# Altium schematic sheet MCU.SchDoc
size B; SheetNumber: 6; SheetTotal: 6; SPICEModelCacheVOGBEKYM: <root> / <DocumentId>VOGBEKYM</DocumentId> / <CacheFrame Number="0"> / <Model Name="xtal" Kind="CKT"> / <Text>*Generic type:crystal pkg:HC33/51 / .SUBCKT XTAL 1 2 PARAMS: FREQ=1Meg RS=750 C=13pf Q=1000 / LX 1 3 {((Q*RS)/(6.2831852*FREQ))} IC=0.5M / CX 3 4 {(1/(Q*6.2831852*FREQ*RS))} / C0 1 2 {C} / RS 4 2 {RS} / .ENDS XTAL</Text> / </Model> / <Model Name="led1" Kind="MDL"> / <Text>*Typ RED GaAs LED: Vf=1.7V Vr=4V If=40mA trr=3uS / *LED Pinout: 1=A, 2=K / .MODEL LED1 D (IS=93.2P RS=42M N=3.73 BV=4 IBV=10U / + CJO=2.97P VJ=.75 M=.333 TT=4.32U)</Text> / </Model> / </CacheFrame> / </root>
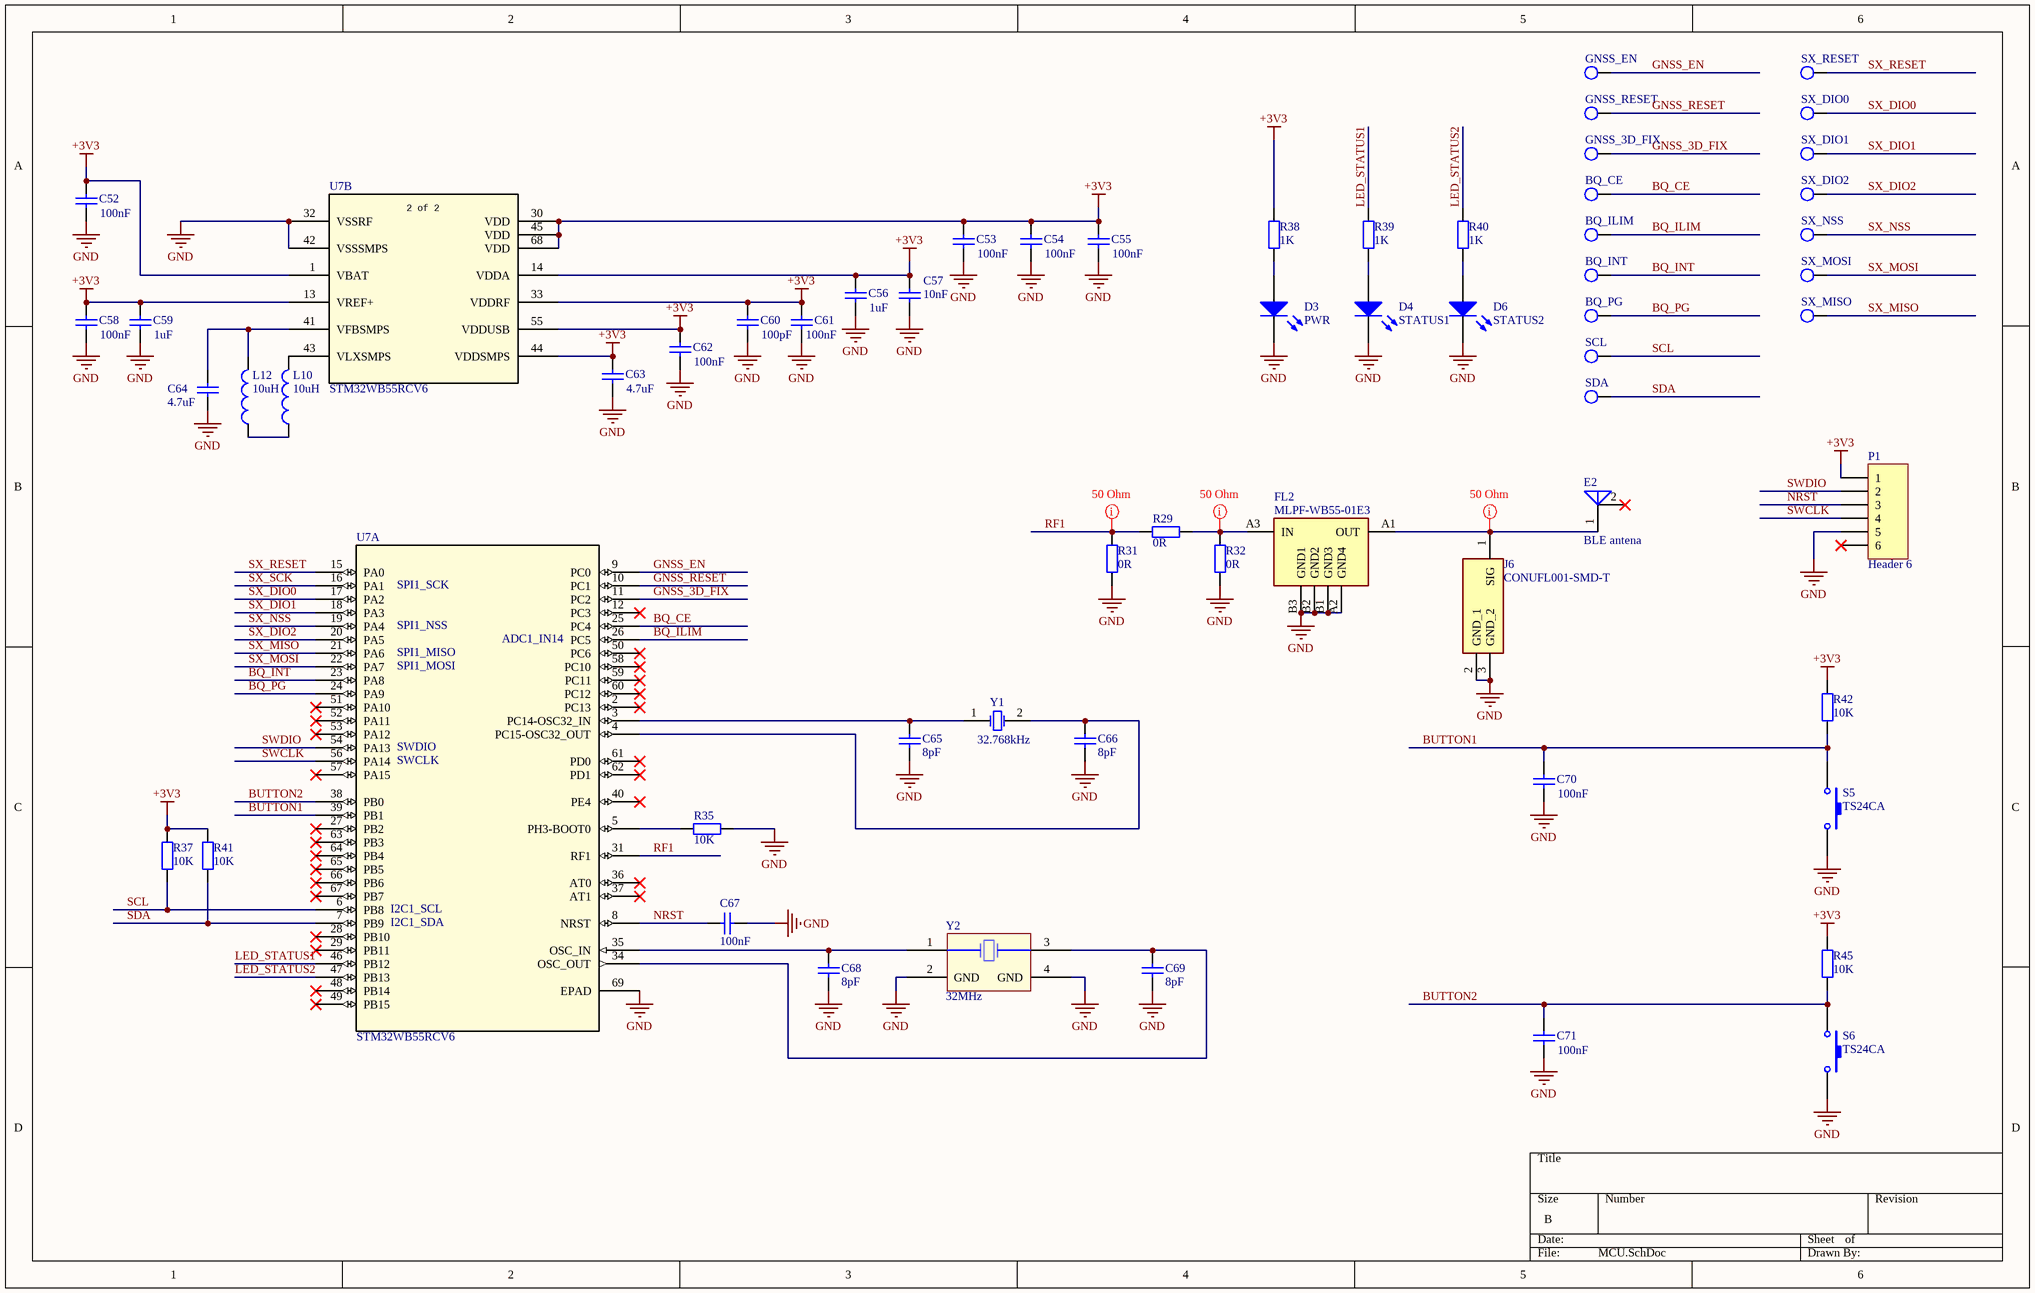
[diagram p0: MCU.SchDoc]

## Parts
BQ_CE  BQ_CE  [testpoint 1 mm]  (value not drawn)  (no BOM)
BQ_ILIM  BQ_ILIM  [testpoint 1 mm]  (value not drawn)  (no BOM)
BQ_INT  BQ_INT  [testpoint 1 mm]  (value not drawn)  (no BOM)
BQ_PG  BQ_PG  [testpoint 1 mm]  (value not drawn)  (no BOM)
C52  100nF  [SMD-0402C]
C53  100nF  [SMD-0402C]
C54  100nF  [SMD-0402C]
C55  100nF  [SMD-0402C]
C56  1uF  [SMD-0402C]
C57  10nF  [SMD-0402C]
C58  100nF  [SMD-0402C]
C59  1uF  [SMD-0402C]
C60  100pF  [SMD-0402C]
C61  100nF  [SMD-0402C]
C62  100nF  [SMD-0402C]
C63  4.7uF  [SMD-0603C]
C64  4.7uF  [SMD-0603C]
C65  8pF  [SMD-0402C]
C66  8pF  [SMD-0402C]
C67  100nF  [SMD-0402C]
C68  8pF  [SMD-0402C]
C69  8pF  [SMD-0402C]
C70  100nF  [SMD-0402C]
C71  100nF  [SMD-0402C]
D3  PWR  [LED 0603]
D4  STATUS1  [LED 0603]
D6  STATUS2  [LED 0603]
E2  BLE antena  [ANT3216LL00R2400A]
FL2  MLPF-WB55-01E3  [MLPF-WB55-01E3]
GNSS_3D_FIX  GNSS_EN  [testpoint 1 mm]  (value not drawn)  (no BOM)
GNSS_EN  GNSS_EN  [testpoint 1 mm]  (value not drawn)  (no BOM)
GNSS_RESET  GNSS_RESET  [testpoint 1 mm]  (value not drawn)  (no BOM)
J6  CONUFL001-SMD-T  [CONUFL001SMDT]
L10  10uH  [SMD-0805-RES]
L12  10uH  [SMD-0805-RES]
P1  Header 6  [TAG_TC2030-IDC-NL]
R29  0R  [SMD-0402-RES]
R31  0R  [SMD-0402-RES]
R32  0R  [SMD-0402-RES]
R35  10K  [SMD-0402-RES]
R37  10K  [SMD-0402-RES]
R38  1K  [SMD-0402-RES]
R39  1K  [SMD-0402-RES]
R40  1K  [SMD-0402-RES]
R41  10K  [SMD-0402-RES]
R42  10K  [SMD-0402-RES]
R45  10K  [SMD-0402-RES]
S5  TS24CA  [TS24CA]
S6  TS24CA  [TS24CA]
SCL  SCL  [testpoint 1 mm]  (value not drawn)  (no BOM)
SDA  SDA  [testpoint 1 mm]  (value not drawn)  (no BOM)
SX_DIO0  SX_DIO0  [testpoint 1 mm]  (value not drawn)  (no BOM)
SX_DIO1  SX_DIO1  [testpoint 1 mm]  (value not drawn)  (no BOM)
SX_DIO2  SX_DIO2  [testpoint 1 mm]  (value not drawn)  (no BOM)
SX_MISO  SX_MISO  [testpoint 1 mm]  (value not drawn)  (no BOM)
SX_MOSI  SX_MOSI  [testpoint 1 mm]  (value not drawn)  (no BOM)
SX_NSS  SX_NSS  [testpoint 1 mm]  (value not drawn)  (no BOM)
SX_RESET  SX_RESET  [testpoint 1 mm]  (value not drawn)  (no BOM)
U7  STM32WB55RCV6  [STM32WB55RCV6]  (parts A,B of 2)
Y1  32.768kHz  [DT1610SB32768B0HPWAA]
Y2  32MHz  [ECS-TXO-20CSMV-320-EY-TR]

## Nets
+3V3: C52.2 C53.2 C54.2 C55.2 C56.2 C57.2 C58.2 C59.2 C60.2 C61.2 C62.2 C63.2 P1.1 R37.2 R38.1 R41.2 R42.2 R45.2 U7.1(VBAT) U7.13(VREF+) U7.14(VDDA) U7.30(VDD) U7.33(VDDRF) U7.44(VDDSMPS) U7.45(VDD) U7.55(VDDUSB) U7.68(VDD)
GND: C52.1 C53.1 C54.1 C55.1 C56.1 C57.1 C58.1 C59.1 C60.1 C61.1 C62.1 C63.1 C64.1 C65.2 C66.2 C67.1 C68.2 C69.2 C70.1 C71.1 D3.2(K) D4.2(K) D6.2(K) FL2.A2(GND4) FL2.B1(GND3) FL2.B2(GND2) FL2.B3(GND1) J6.2(GND_1) J6.3(GND_2) P1.5 R31.1 R32.1 R35.1 S5.2 S6.2 U7.32(VSSRF) U7.42(VSSSMPS) U7.69(EPAD) Y2.2(GND) Y2.4(GND)
BQ_CE: BQ_CE.1 U7.25(PC4)
BQ_ILIM: BQ_ILIM.1 U7.26(PC5)
BQ_INT: BQ_INT.1 U7.23(PA8)
BQ_PG: BQ_PG.1 U7.24(PA9)
BUTTON1: C70.2 R42.1 S5.1 U7.39(PB1)
BUTTON2: C71.2 R45.1 S6.1 U7.38(PB0)
GNSS_3D_FIX: GNSS_3D_FIX.1 U7.11(PC2)
GNSS_EN: GNSS_EN.1 U7.9(PC0)
GNSS_RESET: GNSS_RESET.1 U7.10(PC1)
LED_STATUS1: R39.1 U7.46(PB12)
LED_STATUS2: R40.1 U7.47(PB13)
NRST: C67.2 P1.3 U7.8(NRST)
RF1: R29.2 R31.2 U7.31(RF1)
SCL: R37.1 SCL.1 U7.6(PB8)
SDA: R41.1 SDA.1 U7.7(PB9)
SWCLK: P1.4 U7.56(PA14)
SWDIO: P1.2 U7.54(PA13)
SX_DIO0: SX_DIO0.1 U7.17(PA2)
SX_DIO1: SX_DIO1.1 U7.18(PA3)
SX_DIO2: SX_DIO2.1 U7.20(PA5)
SX_MISO: SX_MISO.1 U7.21(PA6)
SX_MOSI: SX_MOSI.1 U7.22(PA7)
SX_NSS: SX_NSS.1 U7.19(PA4)
SX_RESET: SX_RESET.1 U7.15(PA0)
SX_SCK: U7.16(PA1)
NetC64_2: C64.2 L12.2 U7.41(VFBSMPS)
NetC65_1: C65.1 U7.3(PC14-OSC32_IN) Y1.1(OSC1)
NetC66_1: C66.1 U7.4(PC15-OSC32_OUT) Y1.2(OSC2)
NetC68_1: C68.1 U7.35(OSC_IN) Y2.1
NetC69_1: C69.1 U7.34(OSC_OUT) Y2.3
NetD3_1: D3.1(A) R38.2
NetD4_1: D4.1(A) R39.2
NetD6_1: D6.1(A) R40.2
NetE2_1: E2.1 FL2.A1(OUT) J6.1(SIG)
NetFL2_A3: FL2.A3(IN) R29.1 R32.2
NetL10_1: L10.1 L12.1
NetL10_2: L10.2 U7.43(VLXSMPS)
NetR35_2: R35.2 U7.5(PH3-BOOT0)

Not connected (* = marked no-connect by the designer): E2 2*; P1 6*; U7 2(PC13)* 12(PC3)* 27(PB2)* 28(PB10)* 29(PB11)* 36(AT0)* 37(AT1)* 40(PE4)* 48(PB14)* 49(PB15)* 50(PC6)* 51(PA10)* 52(PA11)* 53(PA12)* 57(PA15)* 58(PC10)* 59(PC11)* 60(PC12)* 61(PD0)* 62(PD1)* 63(PB3)* 64(PB4)* 65(PB5)* 66(PB6)* 67(PB7)*

## Layout directives
net class 50 Ohm BLE GNSS: NetE2_1, NetFL2_A3, RF1

## Notes on the sheet
- (in symbol STM32WB55RCV6, part A) SPI1_SCK; SPI1_NSS; ADC1_IN14; SPI1_MISO; SPI1_MOSI; SWDIO; SWCLK; I2C1_SCL; I2C1_SDA
- (in symbol STM32WB55RCV6, part B) 2 of 2

## Library data of the parts
BQ_CE BQ_ILIM BQ_INT BQ_PG GNSS_3D_FIX GNSS_EN GNSS_RESET SCL SDA SX_DIO0-SX_DIO2 SX_MISO SX_MOSI SX_NSS SX_RESET = testpoint
C52-C71 = Cap: Capacitor; Published: 8-Jun-2000; LatestRevisionDate: 17-Jul-2002; LatestRevisionNote: Re-released for DXP Platform.; PackageReference: RAD-0.3; Publisher: Altium Limited; PackageDescription: Radial Cap, Thru-Hole; 2 Leads; 0.3 in Pin Spacing; Supplier 1: Mouser
  C52-C55 C58 C61 C62 C67 C70 C71: Value: 100nF; Supplier Part Number 1: 603-CC402KRX7R7BB104
  C56 C59: Value: 1uF; Supplier Part Number 1: 81-GRM155R61E105KA2D
  C57: Value: 10nF; Supplier Part Number 1: 791-MT15B103K500CT
  C60: Value: 100pF; Supplier Part Number 1: 80-C0402C101J5GAC
  C63 C64: Value: 4.7uF; Supplier Part Number 1: 187-CL10A475KO8NNNC
  C65 C66 C68 C69: Value: 8pF; Supplier Part Number 1: 791-0402N8R0D500CT
D3 D4 D6 = LED1: Single Colour LEDs SMD Green 2.5-16 mcd; Published: 8-Jun-2000; LatestRevisionDate: 08-Jul-2005; LatestRevisionNote: Mech Layer 1 removed.; PackageReference: LED-1; Publisher: Altium Limited; PackageDescription: LED; 2 Leads; Supplier 1: Mouser; Supplier Part Number 1: 755-SML-D12P8WT86
E2 = Antenna: ANT3216LL00R2400A; Supplier 1: Mouser; Supplier Part Number 1: 603-ANT3216LL00R2400
FL2 = MLPF-WB55-01E3: Manufacturer_Name: STMicroelectronics; Datasheet Link: https://www.st.com/resource/en/datasheet/mlpf-wb55-01e3.pdf; Manufacturer_Part_Number: MLPF-WB55-01E3; Mouser Part Number: 511-MLPF-WB55-01E3; Mouser Price/Stock: https://www.mouser.co.uk/ProductDetail/STMicroelectronics/MLPF-WB55-01E3?qs=vLWxofP3U2xV%2FkxL9PmCDA%3D%3D; Arrow Part Number: MLPF-WB55-01E3; Arrow Price/Stock: https://www.arrow.com/en/products/mlpf-wb55-01e3/stmicroelectronics?utm_currency=USD&region=nac; Supplier 1: Mouser; Supplier Part Number 1: 511-MLPF-WB55-01E3
J6 = CONUFL001-SMD-T: Connector; Manufacturer_Name: TE Connectivity; Datasheet Link: https://eu.mouser.com/datasheet/2/418/9/ENG_DS_CONUFL001_SMD_T_B-3238717.pdf; Height: 1.3mm; Manufacturer_Part_Number: CONUFL001-SMD-T; Mouser Part Number: N/A; Mouser Price/Stock: https://www.mouser.co.uk/ProductDetail/TE-Connectivity/CONUFL001-SMD-T?qs=3Rah4i%252BhyCHmRzMH%252BkLkPQ%3D%3D; Arrow Part Number: CONUFL001-SMD-T; Arrow Price/Stock: https://www.arrow.com/en/products/conufl001-smd-t/te-connectivity?utm_currency=USD&region=europe; Supplier 1: Mouser; Supplier Part Number 1: 712-CONUFL001-SMD-T
L10 L12 = Inductor: Code_IEC: 1005; Published: 8-Jun-2000; LatestRevisionDate: 29-May-2009; LatestRevisionNote: IPC-7351 Footprint Added.; PackageReference: 0402-A; Publisher: Altium Limited; PackageDescription: Chip Inductor; Code_JEITA: 0402; Value: 10uH; Supplier 1: Mouser; Supplier Part Number 1: 81-LQM21DH100M70L
P1 = Header 6: Header, 6-Pin; LatestRevisionDate: 17-Jul-2002; LatestRevisionNote: Re-released for DXP Platform.; Publisher: Altium Limited
R29 R31 R32 R35 R37-R42 R45 = Res2: Resistor; Published: 8-Jun-2000; LatestRevisionDate: 17-Jul-2002; LatestRevisionNote: Re-released for DXP Platform.; PackageReference: AXIAL-0.4; Publisher: Altium Limited; PackageDescription: Axial Device, Thru-Hole; 2 Leads; 0.4 in Pin Spacing; Supplier 1: Mouser
  R29 R31 R32: Value: 0R; Supplier Part Number 1: 603-RC0402FR-070RL
  R35 R37 R41 R42 R45: Value: 10K; Supplier Part Number 1: 603-RC0402FR-7D10KL
  R38-R40: Value: 1K; Supplier Part Number 1: 708-RMCF0402FT1K00
S5 S6 = SW-PB: Switch; Published: 24-Mar-1999; LatestRevisionDate: 17-Jul-2002; LatestRevisionNote: Re-released for DXP Platform.; PackageReference: SPST-2; Publisher: Altium Limited; PackageDescription: Switch; 2 Leads
U7 = STM32WB55RCV6: Ultra-low-power dual core Arm Cortex-M4 MCU 64 MHz, Cortex-M0+ 32 MHz with 256 Kbytes of Flash memory, Bluetooth LE 5.4, 802.15.4, Zigbee, Thread, Matter, USB, LCD, AES-256; Manufacturer_Name: STMicroelectronics; Copyright: Copyright (C) 2025 Ultra Librarian. All rights reserved.; Manufacturer_Part_Number: STM32WB55RCV6; RefDes: RefDes; Type: Type
Y1 = XTAL: Crystal Oscillator / CM8V-T1A-32.768kHz-7pF-20PPM-TA-QC; Published: 8-Jun-2000; LatestRevisionDate: 17-Jul-2002; LatestRevisionNote: Re-released for DXP Platform.; PackageReference: R38; Publisher: Altium Limited; PackageDescription: Crystal, Thru-Hole; 2 Leads; Body 3.1 x 8.2 mm (Dia.xH); Supplier 1: Mouser; Supplier Part Number 1: 581-DT1610SB32768B0H
Y2 = Xtal 4 pin: ECS-320-8-37B2-CGP-TR / Crystals 32.000 MHz 8 pF ECX-1637B2 +/-10/30ppm -40 - +105C +/-2 ppm Aging 2016 4-SMD RoHS; Supplier 1: Mouser; Supplier Part Number 1: 520-320-8-37B2-CGPTR